# EAGLE design cable_with_five_imu (EAGLE 9.6.2)
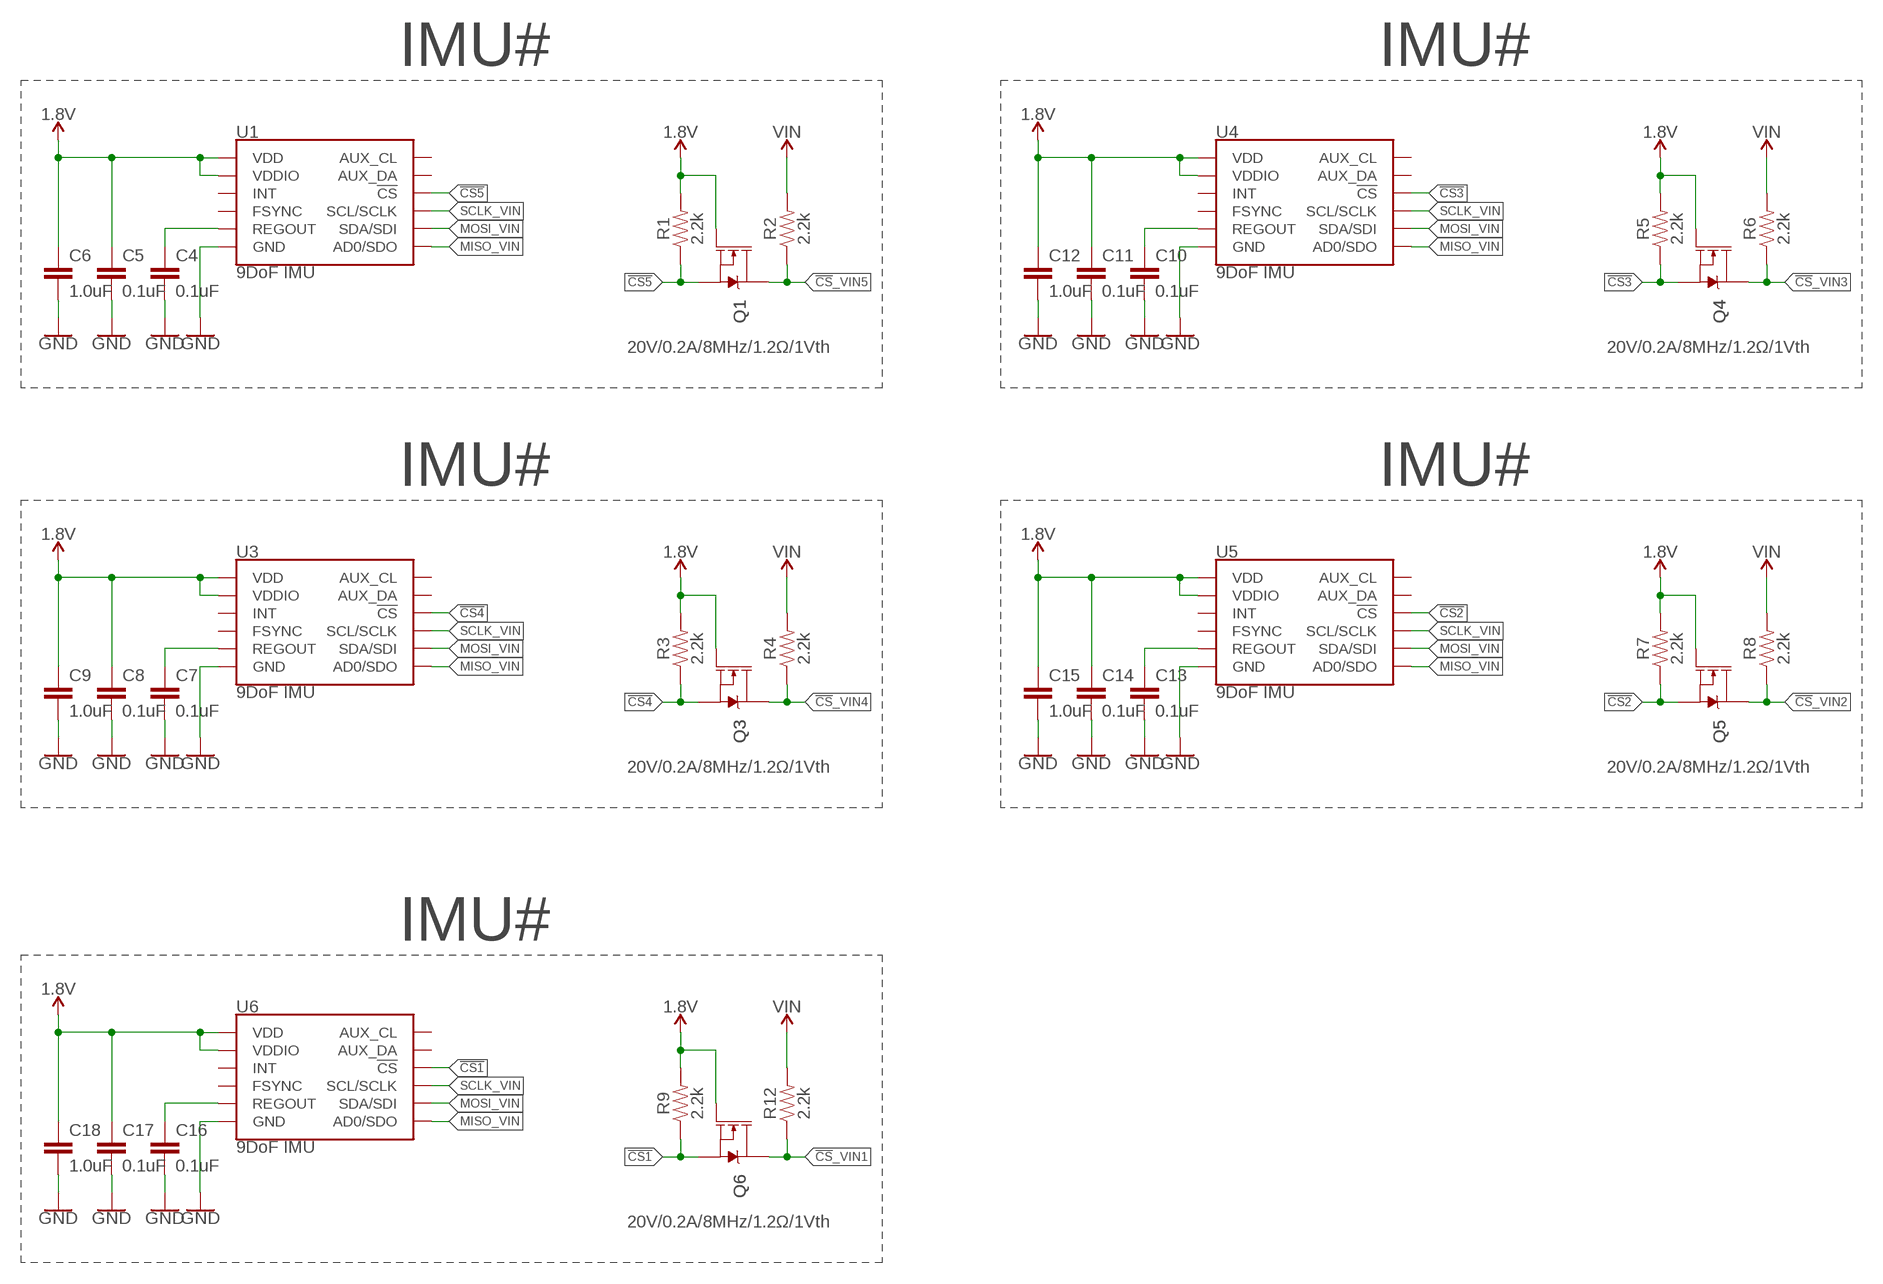
[diagram p0: schematic, sheet 1]

## Parts
C4  0.1uF  0.1UF-0603-25V-5%  [0603]
C5  0.1uF  0.1UF-0603-25V-5%  [0603]
C6  1.0uF  1.0UF-0603-16V-10%-X7R  [0603]
C7  0.1uF  0.1UF-0603-25V-5%  [0603]
C8  0.1uF  0.1UF-0603-25V-5%  [0603]
C9  1.0uF  1.0UF-0603-16V-10%-X7R  [0603]
C10  0.1uF  0.1UF-0603-25V-5%  [0603]
C11  0.1uF  0.1UF-0603-25V-5%  [0603]
C12  1.0uF  1.0UF-0603-16V-10%-X7R  [0603]
C13  0.1uF  0.1UF-0603-25V-5%  [0603]
C14  0.1uF  0.1UF-0603-25V-5%  [0603]
C15  1.0uF  1.0UF-0603-16V-10%-X7R  [0603]
C16  0.1uF  0.1UF-0603-25V-5%  [0603]
C17  0.1uF  0.1UF-0603-25V-5%  [0603]
C18  1.0uF  1.0UF-0603-16V-10%-X7R  [0603]
Q1  20V/0.2A/8MHz/1.2Ω/1Vth  MOSFET-NCH-RE1C002UN  [SOT-416FL]
Q3  20V/0.2A/8MHz/1.2Ω/1Vth  MOSFET-NCH-RE1C002UN  [SOT-416FL]
Q4  20V/0.2A/8MHz/1.2Ω/1Vth  MOSFET-NCH-RE1C002UN  [SOT-416FL]
Q5  20V/0.2A/8MHz/1.2Ω/1Vth  MOSFET-NCH-RE1C002UN  [SOT-416FL]
Q6  20V/0.2A/8MHz/1.2Ω/1Vth  MOSFET-NCH-RE1C002UN  [SOT-416FL]
R1  2.2k  2.2KOHM-0402T-1/16W-1%  [0402-TIGHT]
R2  2.2k  2.2KOHM-0402T-1/16W-1%  [0402-TIGHT]
R3  2.2k  2.2KOHM-0402T-1/16W-1%  [0402-TIGHT]
R4  2.2k  2.2KOHM-0402T-1/16W-1%  [0402-TIGHT]
R5  2.2k  2.2KOHM-0402T-1/16W-1%  [0402-TIGHT]
R6  2.2k  2.2KOHM-0402T-1/16W-1%  [0402-TIGHT]
R7  2.2k  2.2KOHM-0402T-1/16W-1%  [0402-TIGHT]
R8  2.2k  2.2KOHM-0402T-1/16W-1%  [0402-TIGHT]
R9  2.2k  2.2KOHM-0402T-1/16W-1%  [0402-TIGHT]
R12  2.2k  2.2KOHM-0402T-1/16W-1%  [0402-TIGHT]
U1  9DoF IMU  ICM-20948  [QFN24-3X3]
U3  9DoF IMU  ICM-20948  [QFN24-3X3]
U4  9DoF IMU  ICM-20948  [QFN24-3X3]
U5  9DoF IMU  ICM-20948  [QFN24-3X3]
U6  9DoF IMU  ICM-20948  [QFN24-3X3]

## Nets
1.8V: C5.1 C6.1 C8.1 C9.1 C11.1 C12.1 C14.1 C15.1 C17.1 C18.1 Q1.1(G) Q3.1(G) Q4.1(G) Q5.1(G) Q6.1(G) R1.2 R3.2 R5.2 R7.2 R9.2 U1.8(VDDIO) U1.13(VDD) U3.8(VDDIO) U3.13(VDD) U4.8(VDDIO) U4.13(VDD) U5.8(VDDIO) U5.13(VDD) U6.8(VDDIO) U6.13(VDD)
!CS1: Q6.2(S) R9.1 U6.22(!CS)
!CS2: Q5.2(S) R7.1 U5.22(!CS)
!CS3: Q4.2(S) R5.1 U4.22(!CS)
!CS4: Q3.2(S) R3.1 U3.22(!CS)
!CS5: Q1.2(S) R1.1 U1.22(!CS)
!CS!_VIN1: Q6.3(D) R12.1
!CS!_VIN2: Q5.3(D) R8.1
!CS!_VIN3: Q4.3(D) R6.1
!CS!_VIN4: Q3.3(D) R4.1
!CS!_VIN5: Q1.3(D) R2.1
GND: C4.2 C5.2 C6.2 C7.2 C8.2 C9.2 C10.2 C11.2 C12.2 C13.2 C14.2 C15.2 C16.2 C17.2 C18.2 U1.18(GND) U1.20(GND) U3.18(GND) U3.20(GND) U4.18(GND) U4.20(GND) U5.18(GND) U5.20(GND) U6.18(GND) U6.20(GND)
MISO_VIN: U1.9(AD0/SDO) U3.9(AD0/SDO) U4.9(AD0/SDO) U5.9(AD0/SDO) U6.9(AD0/SDO)
MOSI_VIN: U1.24(SDA/SDI) U3.24(SDA/SDI) U4.24(SDA/SDI) U5.24(SDA/SDI) U6.24(SDA/SDI)
N$2: C4.1 U1.10(REGOUT)
N$3: C7.1 U3.10(REGOUT)
N$4: C10.1 U4.10(REGOUT)
N$5: C13.1 U5.10(REGOUT)
N$6: C16.1 U6.10(REGOUT)
SCLK_VIN: U1.23(SCL/SCLK) U3.23(SCL/SCLK) U4.23(SCL/SCLK) U5.23(SCL/SCLK) U6.23(SCL/SCLK)
VIN: R2.2 R4.2 R6.2 R8.2 R12.2
Unconnected: U1.7(AUX_CL) U1.11(FSYNC) U1.12(INT) U1.21(AUX_DA) U3.7(AUX_CL) U3.11(FSYNC) U3.12(INT) U3.21(AUX_DA) U4.7(AUX_CL) U4.11(FSYNC) U4.12(INT) U4.21(AUX_DA) U5.7(AUX_CL) U5.11(FSYNC) U5.12(INT) U5.21(AUX_DA) U6.7(AUX_CL) U6.11(FSYNC) U6.12(INT) U6.21(AUX_DA)

## Notes on the sheet
- IMU# | IMU#
- IMU# | IMU#
- IMU#

## Library data of the parts
C4 C5 C7 C8 C10 C11 C13 C14 C16 C17 = SparkFun-Capacitors:0.1UF: 0.1µF ceramic capacitors A capacitor is a passive two-terminal electrical component used to store electrical energy temporarily in an electric field.; PROD_ID: CAP-08604
C6 C9 C12 C15 C18 = SparkFun-Capacitors:1.0UF: 1µF ceramic capacitors A capacitor is a passive two-terminal electrical component used to store electrical energy temporarily in an electric field.; PROD_ID: CAP-13930
Q1 Q3-Q6 = SparkFun-DiscreteSemi:MOSFET-NCH: N-channel MOSFETs Voltage controlled devices that allow control of high current outputs. SparkFun Products: SparkFun OpenScale <https://www.sparkfun.com/products/13261> SparkFun Digital Sandbox <https://www.sparkfun.com/products/12651> SparkFun Monster Moto Shield <https://www.sparkfun.com/products/10182> SparkFun MOSFET Power Controller <https://www.sparkfun.com/products/11214>; PROD_ID: TRANS_14399
R1-R9 R12 = SparkFun-Resistors:2.2KOHM: 2.2kΩ resistor A resistor is a passive two-terminal electrical component that implements electrical resistance as a circuit element. Resistors act to reduce current flow, and, at the same time, act to lower voltage levels within circuits. - Wikipedia; PROD_ID: RES-14341
U1 U3-U6 = SparkFun-Sensors:ICM-20948: ICM-20948 9 Degree of Freedom IMU World’s lowest power 9-axis MotionTracking device that is ideally suited for smartphones, tablets, wearable sensors, and IoT applications. Includes onboard Digital Motion Processor to offload computations from the host processor Datasheet <https://cdn.sparkfun.com/assets/learn_tutorials/5/5/0/MPU9250REV1.0.pdf> SparkFun Products: SparkFun IMU Breakout - ICM-20948 <https://www.sparkfun.com/products/15182>; PROD_ID: IC-14247

## Net classes
1 power: width 0.406 mm
2 spi: width 0.203 mm

## Board
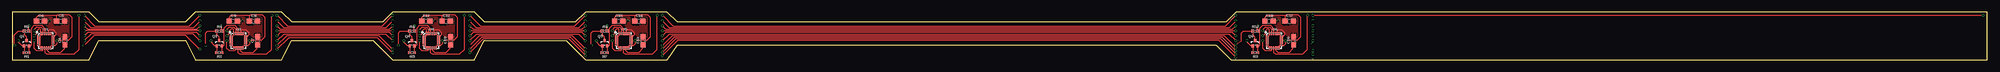
[diagram p1: board, top side]
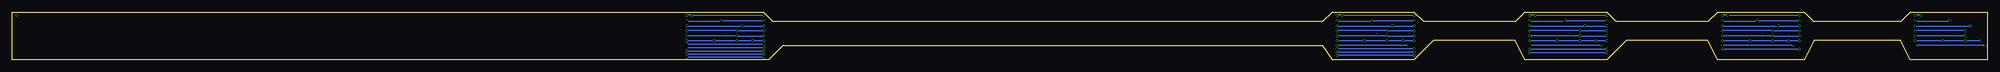
[diagram p2: board, bottom side, seen from below]

Size 410 x 10 mm. Coordinates in mm from the lower left corner, seen from the top.
Outline: 0,0 16,0 18,4 36,4 38,0 56,0 58,4 75,4 79,0 96,0 98,4 115,4 119,0 136,0 138,3 250,3 253,0 254,0 410,0 410,10 254,10 252,8 138,8 136,10 119,10 117,8 98,8 96,10 79,10 77,8 58,8 56,10 38,10 36,8 18,8 16,10 0,10 0,0
Copper layers (1*16): Top 0.035mm / dielectric 1.6mm / Bottom 0.035mm
Design rules "jlcpcb-2layers *": minimum track width 5mil, minimum drill 0.3mm, track to track 5mil, track to pad 5mil, pad to pad 5mil, via to via 5mil, smd to smd 5mil, copper to edge 0.2mm, drill to drill 6mil, minimum pad ring 10mil, minimum via ring 3mil, stop-mask expansion 4mil, vias tented up to drill 20mil, thermal gap 10mil

### Footprints (pad centres in the part's own frame; a part is rotated, then mirrored left to right if it is on the bottom)
0603 = smd 1.1 x 1: 1 -0.85,0; 2 0.85,0
SOT-416FL = smd 0.46 x 0.65: 1 -0.5,-1.1; 2 0.5,-1.1; 3 0,0.05
0402-TIGHT = smd 0.6 x 0.6: 1 -0.5,0; 2 0.5,0
QFN24-3X3 = smd 0.495 x 0.25: 1 -1.552,1; 6 -1.552,-1; 13 1.552,-1; 18 1.552,1 | smd 0.6 x 0.25: 2 -1.5,0.6; 3 -1.5,0.2; 4 -1.5,-0.2; 5 -1.5,-0.6; 14 1.5,-0.6; 15 1.5,-0.2; 16 1.5,0.2; 17 1.5,0.6 | smd 0.25 x 0.495: 7 -1,-1.552; 12 1,-1.552; 19 1,1.552; 24 -1,1.552 | smd 0.25 x 0.6: 8 -0.6,-1.5; 9 -0.2,-1.5; 10 0.2,-1.5; 11 0.6,-1.5; 20 0.6,1.5; 21 0.2,1.5; 22 -0.2,1.5; 23 -0.6,1.5

### Placement (x,y rotation side)
C4  11,4 90 top
C5  10.1,8.1 0 top
C6  5.9,8.1 0 top
C7  51,4 90 top
C8  50.1,8.1 0 top
C9  45.9,8.1 0 top
C10  91,4 90 top
C11  90.1,8.1 0 top
C12  85.9,8.1 0 top
C13  131,4 90 top
C14  130.1,8.1 0 top
C15  125.9,8.1 0 top
C16  266,4 90 top
C17  265.1,8.1 0 top
C18  260.9,8.1 0 top
Q1  3,4 0 top
Q3  43,4 0 top
Q4  83,4 0 top
Q5  123,4 0 top
Q6  258,4 0 top
R1  3,1.5 180 top
R2  3,6 0 top
R3  43,1.5 180 top
R4  43,6 0 top
R5  83,1.5 180 top
R6  83,6 0 top
R7  123,1.5 180 top
R8  123,6 0 top
R9  258,1.5 180 top
R12  258,6 0 top
U1  7,4 0 top
U3  47,4 0 top
U4  87,4 0 top
U5  127,4 0 top
U6  262,4 0 top

### Tracks (layer width: path | path; a pad name or v marks a point on that pad's centre or on a via)
1.8V  (via drill 0.35, 0.35 pad 0.55)
  Top 0.203: U1.8 6.4,1.99 6.26,1.85 5.15,1.85 4.6,2.4 v4.6,4 | v1.3,4 1.3,3.7 2.1,2.9 Q1.1 R1.2 | U1.13 9,3 9.3,3.3 v9.3,4 9.37,4.07 11.67,4.07 12.5,4.9 12.5,8.8 12,9.3 9.4,9.3 | 9.4,9.3 9.2,9.1 9.2,8.15 C5.1 | C6.1 5.05,8.85 5.5,9.3 9.4,9.3 | U3.8 46.4,1.99 46.26,1.85 45.15,1.85 44.6,2.4 v44.6,4 | v41.3,4 41.3,3.7 42.1,2.9 Q3.1 R3.2 | U3.13 49,3 49.3,3.3 v49.3,4 49.37,4.07 51.67,4.07 52.5,4.9 52.5,8.8 52,9.3 49.4,9.3 | 49.4,9.3 49.2,9.1 49.2,8.15 C8.1 | C9.1 45.05,8.85 45.5,9.3 49.4,9.3 | v15,4 16.44,5.44 37.55,5.44 v38.99,4 | U4.8 86.4,1.99 86.26,1.85 85.15,1.85 84.6,2.4 v84.6,4 | v81.3,4 81.3,3.7 82.1,2.9 Q4.1 R5.2 | U4.13 89,3 89.3,3.3 v89.3,4 89.37,4.07 91.67,4.07 92.5,4.9 92.5,8.8 92,9.3 89.4,9.3 | 89.4,9.3 89.2,9.1 89.2,8.15 C11.1 | C12.1 85.05,8.85 85.5,9.3 89.4,9.3 | v55,4 56.44,5.44 77.55,5.44 v78.99,4 | U5.8 126.4,1.99 126.26,1.85 125.15,1.85 124.6,2.4 v124.6,4 | v121.3,4 121.3,3.7 122.1,2.9 Q5.1 R7.2 | U5.13 129,3 129.3,3.3 v129.3,4 129.37,4.07 131.67,4.07 132.5,4.9 132.5,8.8 132,9.3 129.4,9.3 | 129.4,9.3 129.2,9.1 129.2,8.15 C14.1 | C15.1 125.05,8.85 125.5,9.3 129.4,9.3 | v118.99,4 117.59,5.4 96.4,5.4 v95,4 | U6.8 261.4,1.99 261.26,1.85 260.15,1.85 259.6,2.4 v259.6,4 | v256.3,4 256.3,3.7 257.1,2.9 Q6.1 R9.2 | U6.13 264,3 264.3,3.3 v264.3,4 264.37,4.07 266.67,4.07 267.5,4.9 267.5,8.8 267,9.3 264.4,9.3 | 264.4,9.3 264.2,9.1 264.2,8.15 C17.1 | C18.1 260.05,8.85 260.5,9.3 264.4,9.3 | v135,4 136.44,5.44 252.55,5.44 v253.99,4
  Bottom 0.203: v15,4 v9.3,4 v4.6,4 v1.3,4 | v55,4 v49.3,4 v44.6,4 v41.3,4 v38.99,4 | v95,4 v89.3,4 v84.6,4 v81.3,4 v78.99,4 | v135,4 v129.3,4 v124.6,4 v121.3,4 v118.99,4 | v270,4 268.2,4 v264.3,4 v259.6,4 v256.3,4 v253.99,4
!CS1  (1 unrouted)
  Top 0.203: U6.22 261.81,6.58 261.16,7.23 259.64,7.23 259.04,6.63 259.04,3.14 258.8,2.9 Q6.2 R9.1
!CS2  (1 unrouted)
  Top 0.203: U5.22 126.81,6.58 126.16,7.23 124.64,7.23 124.04,6.63 124.04,3.14 123.8,2.9 Q5.2 R7.1
!CS3  (1 unrouted)
  Top 0.203: U4.22 86.81,6.58 86.16,7.23 84.64,7.23 84.04,6.63 84.04,3.14 83.8,2.9 Q4.2 R5.1
!CS4  (1 unrouted)
  Top 0.203: U3.22 46.81,6.58 46.16,7.23 44.64,7.23 44.04,6.63 44.04,3.14 43.8,2.9 Q3.2 R3.1
!CS5  (1 unrouted)
  Top 0.203: U1.22 6.81,6.58 6.16,7.23 4.64,7.23 4.04,6.63 4.04,3.14 3.8,2.9 Q1.2 R1.1
!CS!_VIN1  (via drill 0.35)
  Top 0.203: Q6.3 258,4.8 257.5,5.3 R12.1 255.6,6 255.2,5.6 255.2,3.9 v254,3.3
  Bottom 0.203: v269.99,3.33 254.03,3.33 v254,3.3
!CS!_VIN2  (via drill 0.35)
  Top 0.203: Q5.3 123,4.8 122.5,5.3 R8.1 120.6,6 120.2,5.6 v120.2,3 | v134.97,3 137.07,5.1 251.5,5.1 v254,2.6
  Bottom 0.203: v120.2,3 v134.97,3 | v270,2.6 v254,2.6
!CS!_VIN3  (via drill 0.35)
  Top 0.203: Q4.3 83,4.8 82.5,5.3 R6.1 80.6,6 80.2,5.6 v80.2,3 | v94.97,3 97.04,5.07 116.23,5.07 v119,2.3 | v135,2.3 137.47,4.77 251.13,4.77 v254,1.9
  Bottom 0.203: v80.2,3 v94.97,3 | v119,2.3 v135,2.3 | v270,1.9 v254,1.9
!CS!_VIN4  (via drill 0.35)
  Top 0.203: Q3.3 43,4.8 42.5,5.3 R4.1 40.6,6 40.2,5.6 v40.2,3.1 | v54.97,3 57.07,5.1 76.1,5.1 v79,2.2 | v95,2.2 97.54,4.74 115.86,4.74 v119,1.6 | v135,1.6 137.84,4.44 250.76,4.44 v254,1.2
  Bottom 0.203: v54.97,3 54.87,3.1 v40.2,3.1 | v79,2.2 v95,2.2 | v119,1.6 v135,1.6 | v270,1.2 v254,1.2
!CS!_VIN5  (via drill 0.35)
  Top 0.203: Q1.3 3,4.8 2.5,5.3 R2.1 1.3,6 0.5,5.2 v0.5,3 | v14.97,3 17.08,5.11 36,5.11 38.91,2.2 v39,2.2 | v54.97,2.2 57.47,4.7 75.8,4.7 v79,1.5 | v95,1.5 97.91,4.41 115.49,4.41 v119,0.9 | v135,0.9 138.21,4.11 250.39,4.11 v254,0.5
  Bottom 0.203: v0.5,3 v14.97,3 | v39,2.2 v54.97,2.2 | v79,1.5 v95,1.5 | v119,0.9 v135,0.9 | v254,0.5 v270,0.5
GND  (via drill 0.35)
  Top 0.203: U1.20 7.6,6.1 7.8,6.3 8.5,6.3 9.1,5.7 9.1,5.2 8.9,5 U1.18 | U3.20 47.6,6.1 47.8,6.3 48.5,6.3 49.1,5.7 49.1,5.2 48.9,5 U3.18 | v15,8.1 16.34,6.76 37.66,6.76 v39,8.1 | U4.20 87.6,6.1 87.8,6.3 88.5,6.3 89.1,5.7 89.1,5.2 88.9,5 U4.18 | v55,8.1 56.34,6.76 77.66,6.76 v79,8.1 | U5.20 127.6,6.1 127.8,6.3 128.5,6.3 129.1,5.7 129.1,5.2 128.9,5 U5.18 | v95,8.1 96.34,6.76 117.66,6.76 v119,8.1 | U6.20 262.6,6.1 262.8,6.3 263.5,6.3 264.1,5.7 264.1,5.2 263.9,5 U6.18 | v135,8.1 136.34,6.76 252.66,6.76 v254,8.1
  Bottom 0.203: v15,8.1 v7.8,8.1 | v55,8.1 v47.8,8.1 v39,8.1 | v95,8.1 v87.8,8.1 v79,8.1 | v135,8.1 v127.8,8.1 v119,8.1 | v270,8.1 v262.8,8.1 v254,8.1
  pour Top: 6.2,8.9 6.2,7.7 6.6,7.7 7.5,6.8 7.5,6.4 7.9,6 8.7,6 10,4.7 11.7,4.7 11.9,4.9 11.9,8.7 11.7,8.9 10.4,8.9 10.2,8.7 10.2,6.9 8.9,6.9 8.4,7.4 8.4,8.7 8.2,8.9
  pour Top: 46.2,8.9 46.2,7.7 46.6,7.7 47.5,6.8 47.5,6.4 47.9,6 48.7,6 50,4.7 51.7,4.7 51.9,4.9 51.9,8.7 51.7,8.9 50.4,8.9 50.2,8.7 50.2,6.9 48.9,6.9 48.4,7.4 48.4,8.7 48.2,8.9
  pour Top: 86.2,8.9 86.2,7.7 86.6,7.7 87.5,6.8 87.5,6.4 87.9,6 88.7,6 90,4.7 91.7,4.7 91.9,4.9 91.9,8.7 91.7,8.9 90.4,8.9 90.2,8.7 90.2,6.9 88.9,6.9 88.4,7.4 88.4,8.7 88.2,8.9
  pour Top: 126.2,8.9 126.2,7.7 126.6,7.7 127.5,6.8 127.5,6.4 127.9,6 128.7,6 130,4.7 131.7,4.7 131.9,4.9 131.9,8.7 131.7,8.9 130.4,8.9 130.2,8.7 130.2,6.9 128.9,6.9 128.4,7.4 128.4,8.7 128.2,8.9
  pour Top: 261.2,8.9 261.2,7.7 261.6,7.7 262.5,6.8 262.5,6.4 262.9,6 263.7,6 265,4.7 266.7,4.7 266.9,4.9 266.9,8.7 266.7,8.9 265.4,8.9 265.2,8.7 265.2,6.9 263.9,6.9 263.4,7.4 263.4,8.7 263.2,8.9
MISO_VIN  (via drill 0.35)
  Top 0.203: U1.9 6.8,1.6 7.2,1.2 12.9,1.2 13.9,2.2 v13.9,9.3 | U3.9 46.8,1.6 47.2,1.2 52.9,1.2 53.9,2.2 v53.9,9.3 | v15,9.3 17.2,7.1 36.8,7.1 v39,9.3 | U4.9 86.8,1.6 87.2,1.2 92.9,1.2 93.9,2.2 v93.9,9.3 | v55,9.3 57.21,7.09 76.79,7.09 v79,9.3 | U5.9 126.8,1.6 127.2,1.2 132.9,1.2 133.9,2.2 v133.9,9.3 | v95,9.3 97.21,7.09 116.79,7.09 v119,9.3 | U6.9 261.8,1.6 262.2,1.2 267.9,1.2 268.9,2.2 v268.9,9.3 | v135,9.3 137.2,7.1 251.8,7.1 v254,9.3 | v270,9.3 v409.1,9.3
  Bottom 0.203: v13.9,9.3 v15,9.3 | v55,9.3 v53.9,9.3 v39,9.3 | v95,9.3 v93.9,9.3 v79,9.3 | v135,9.3 v133.9,9.3 v119,9.3 | v270,9.3 v268.9,9.3 v254,9.3
MOSI_VIN  (via drill 0.35)
  Top 0.203: v4.6,5 5.1,5.5 5.1,6 5.5,6.4 5.9,6.4 6,6.3 U1.24 | v44.6,5 45.1,5.5 45.1,6 45.5,6.4 45.9,6.4 46,6.3 U3.24 | v15,5 15.77,5.77 38.23,5.77 v39,5 | v84.6,5 85.1,5.5 85.1,6 85.5,6.4 85.9,6.4 86,6.3 U4.24 | v55,5 55.77,5.77 78.23,5.77 v79,5 | v124.6,5 125.1,5.5 125.1,6 125.5,6.4 125.9,6.4 126,6.3 U5.24 | v119,5 118.23,5.77 95.77,5.77 v95,5 | v259.6,5 260.1,5.5 260.1,6 260.5,6.4 260.9,6.4 261,6.3 U6.24 | v135,5 135.77,5.77 253.23,5.77 v254,5
  Bottom 0.203: v4.6,5 v15,5 | v55,5 v44.6,5 v39,5 | v95,5 v84.6,5 v79,5 | v135,5 v124.6,5 v119,5 | v270,5 v259.6,5 v254,5
N$2
  Top 0.203: U1.10 7.22,2.48 7.22,2.1 7.72,1.6 10.1,1.6 10.9,2.4 C4.1
N$3
  Top 0.203: U3.10 47.22,2.48 47.22,2.1 47.72,1.6 50.1,1.6 50.9,2.4 C7.1
N$4
  Top 0.203: U4.10 87.22,2.48 87.22,2.1 87.72,1.6 90.1,1.6 90.9,2.4 C10.1
N$5
  Top 0.203: U5.10 127.22,2.48 127.22,2.1 127.72,1.6 130.1,1.6 130.9,2.4 C13.1
N$6
  Top 0.203: U6.10 262.22,2.48 262.22,2.1 262.72,1.6 265.1,1.6 265.9,2.4 C16.1
SCLK_VIN  (via drill 0.35)
  Top 0.203: v4.6,6.1 4.6,6.3 5.1,6.8 6.05,6.8 6.4,6.45 U1.23 | v44.6,6.1 44.6,6.3 45.1,6.8 46.05,6.8 46.4,6.45 U3.23 | v39,6.1 v15,6.1 | v84.6,6.1 84.6,6.3 85.1,6.8 86.05,6.8 86.4,6.45 U4.23 | v55,6.1 v79,6.1 | v124.6,6.1 124.6,6.3 125.1,6.8 126.05,6.8 126.4,6.45 U5.23 | v95,6.1 v119,6.1 | v259.6,6.1 259.6,6.3 260.1,6.8 261.05,6.8 261.4,6.45 U6.23 | v135,6.1 v254,6.1
  Bottom 0.203: v4.6,6.1 v15,6.1 | v55,6.1 v44.6,6.1 v39,6.1 | v95,6.1 v84.6,6.1 v79,6.1 | v135,6.1 v124.6,6.1 v119,6.1 | v270,6.1 v259.6,6.1 v254,6.1
VIN  (via drill 0.35)
  Top 0.203: R2.2 v3.5,7.1 | R4.2 v43.5,7.1 | v15,7.1 15.67,6.43 38.33,6.43 v39,7.1 | R6.2 v83.5,7.1 | v55,7.1 55.67,6.43 78.33,6.43 v79,7.1 | R8.2 v123.5,7.1 | v95,7.1 95.67,6.43 118.33,6.43 v119,7.1 | R12.2 v258.5,7.1 | v135,7.1 135.67,6.43 253.33,6.43 v254,7.1
  Bottom 0.203: v15,7.1 v3.5,7.1 | v55,7.1 v43.5,7.1 v39,7.1 | v95,7.1 v83.5,7.1 v79,7.1 | v135,7.1 v123.5,7.1 v119,7.1 | v270,7.1 v258.5,7.1 v254,7.1